# Altium schematic sheet AS5048B_Breakout.SchDoc
size A
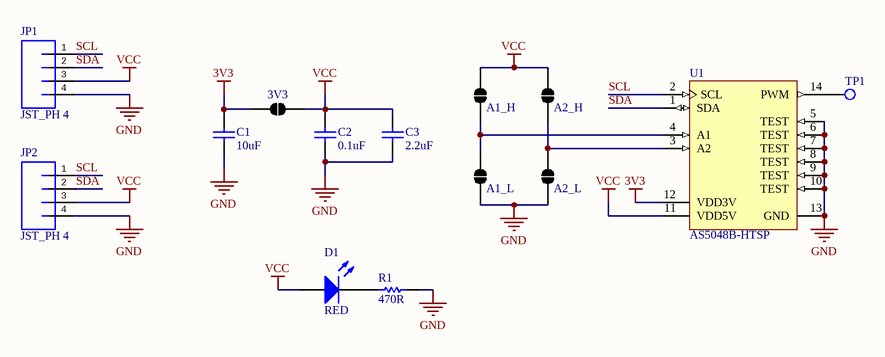
[diagram p0: AS5048B_Breakout.SchDoc]

## Parts
3V3  Solder Jumper  [SOLDER JUMPER]  (value not drawn)
A1_H  A1_H  [SOLDER JUMPER]  (value not drawn)
A1_L  A1_L  [SOLDER JUMPER]  (value not drawn)
A2_H  A2_H  [SOLDER JUMPER]  (value not drawn)
A2_L  A2_L  [SOLDER JUMPER]  (value not drawn)
C1  10uF  [CAPC0603(1608)100_L]
C2  0.1uF  [CAPC0603(1608)100_L]
C3  2.2uF  [CAPC0603(1608)100_L]
D1  RED  [0603_A]
JP1  JST_PH 4  [JST-4-PTH-RIGHT-ANGLE]
JP2  JST_PH 4  [JST-4-PTH-RIGHT-ANGLE]
R1  470R  [RESC0603(1608)_L]
TP1  Test Point  [TEST POINT]  (value not drawn)
U1  AS5048B-HTSP  [AMS-TSSOP-14-5000X4400DE_L]

## Nets
3V3: 3V3.2 C1.1 U1.12(VDD3V)
GND: A1_L.1 A2_L.1 C1.2 C2.1 C3.1 JP1.4 JP2.4 R1.1 U1.5(TEST) U1.6(TEST) U1.7(TEST) U1.8(TEST) U1.9(TEST) U1.10(TEST) U1.13(GND)
VCC: 3V3.1 A1_H.2 A2_H.2 C2.2 C3.2 D1.2(A) JP1.3 JP2.3 U1.11(VDD5V)
SCL: JP1.1 JP2.1 U1.2(SCL)
SDA: JP1.2 JP2.2 U1.1(SDA)
NetA1_H_1: A1_H.1 A1_L.2 U1.4(A1)
NetA2_H_1: A2_H.1 A2_L.2 U1.3(A2)
NetD1_1: D1.1(K) R1.2
NetTP1_1: TP1.1 U1.14(PWM)

## Library data of the parts
A1_H A1_L A2_H A2_L = Solder Jumper
C1 = CMP-1035-02796-1: CAP 10uF 6.3V ±10% 0603 (1608 Metric) Thickness 1mm SMD; Case-EIA: 0603; Tolerance: Â±10%; Case-Metric: 1608; Value: 10uF; Technology: SMT; Rated Voltage: 6.3 V; Max Thickness: 1 mm
C2 = CMP-1035-02591-1: CAP 100nF 50V ±5% 0603 (1608 Metric) Thickness 1mm SMD; Tolerance: Â±5%; Case-Metric: 1608; Case-EIA: 0603; Rated Voltage: 50 V; Max Thickness: 1 mm; Technology: SMT; Value: 100nF
C3 = CMP-1035-02767-1: CAP 2.2uF 25V ±10% 0603 (1608 Metric) Thickness 1mm SMD; Case-EIA: 0603; Tolerance: Â±10%; Case-Metric: 1608; Technology: SMT; Value: 2.2uF; Max Thickness: 1 mm; Rated Voltage: 25 V
D1 = CMP-1426-00001-1: SMD mono-color Chip LED, WL-SMCW, Red; Manufacturer: Wuerth Elektronik; PartNumber: 150060RS75000; Color: Red; PackageReference: 0603_A; ComponentLink2URL: http://katalog.we-online.com/led/datasheet/150060RS75000.pdf; ComponentLink1URL: http://www.we-online.com; ComponentLink1Description: Manufacturer URL; ComponentLink2Description: Datasheet
R1 = CMP-1012-00066-1: 470R 0.1W 5% 0603 (1608 Metric)  SMD; Case-Metric: 1608; Case-EIA: 0603; Value: 470.00 Ohm; Tolerance: 5 %; Technology: SMT; Power: 0.1 W
U1 = CMP-0555-00031-2: Magnetic Rotary Encoder 14-bit Angular Position Sensor, 3.3 or 5 V, TSSOP-14, Pb-Free, Reel; Manufacturer: AMS; Supply Voltage (V): 3.3 or 5.0; Output: IÂ²C, PWM; PackageDescription: 14-Pin Small Outline Package, 5 x 4.4 mm Body, 0.65 mm Pitch; Mounting Technology: Surface Mount; ComponentLink2URL: http://www.ams.com/eng/content/download/438523/1341157/143016; ComponentLink2Description: Datasheet; PackageReference: TSSOP-14; Features: IÂ²C, PWM, In System Programmable; PackageVersion: Rev. 2.7, 10/2010; Code_JEDEC: MO-153; DatasheetVersion: Rev. 1.3; Resolution: 14-bit; PartNumber: AS5048B-HTSP; ComponentLink1Description: Manufacturer URL; ComponentLink1URL: www.ams.com